# Altium project PCB_Project.PrjPcb
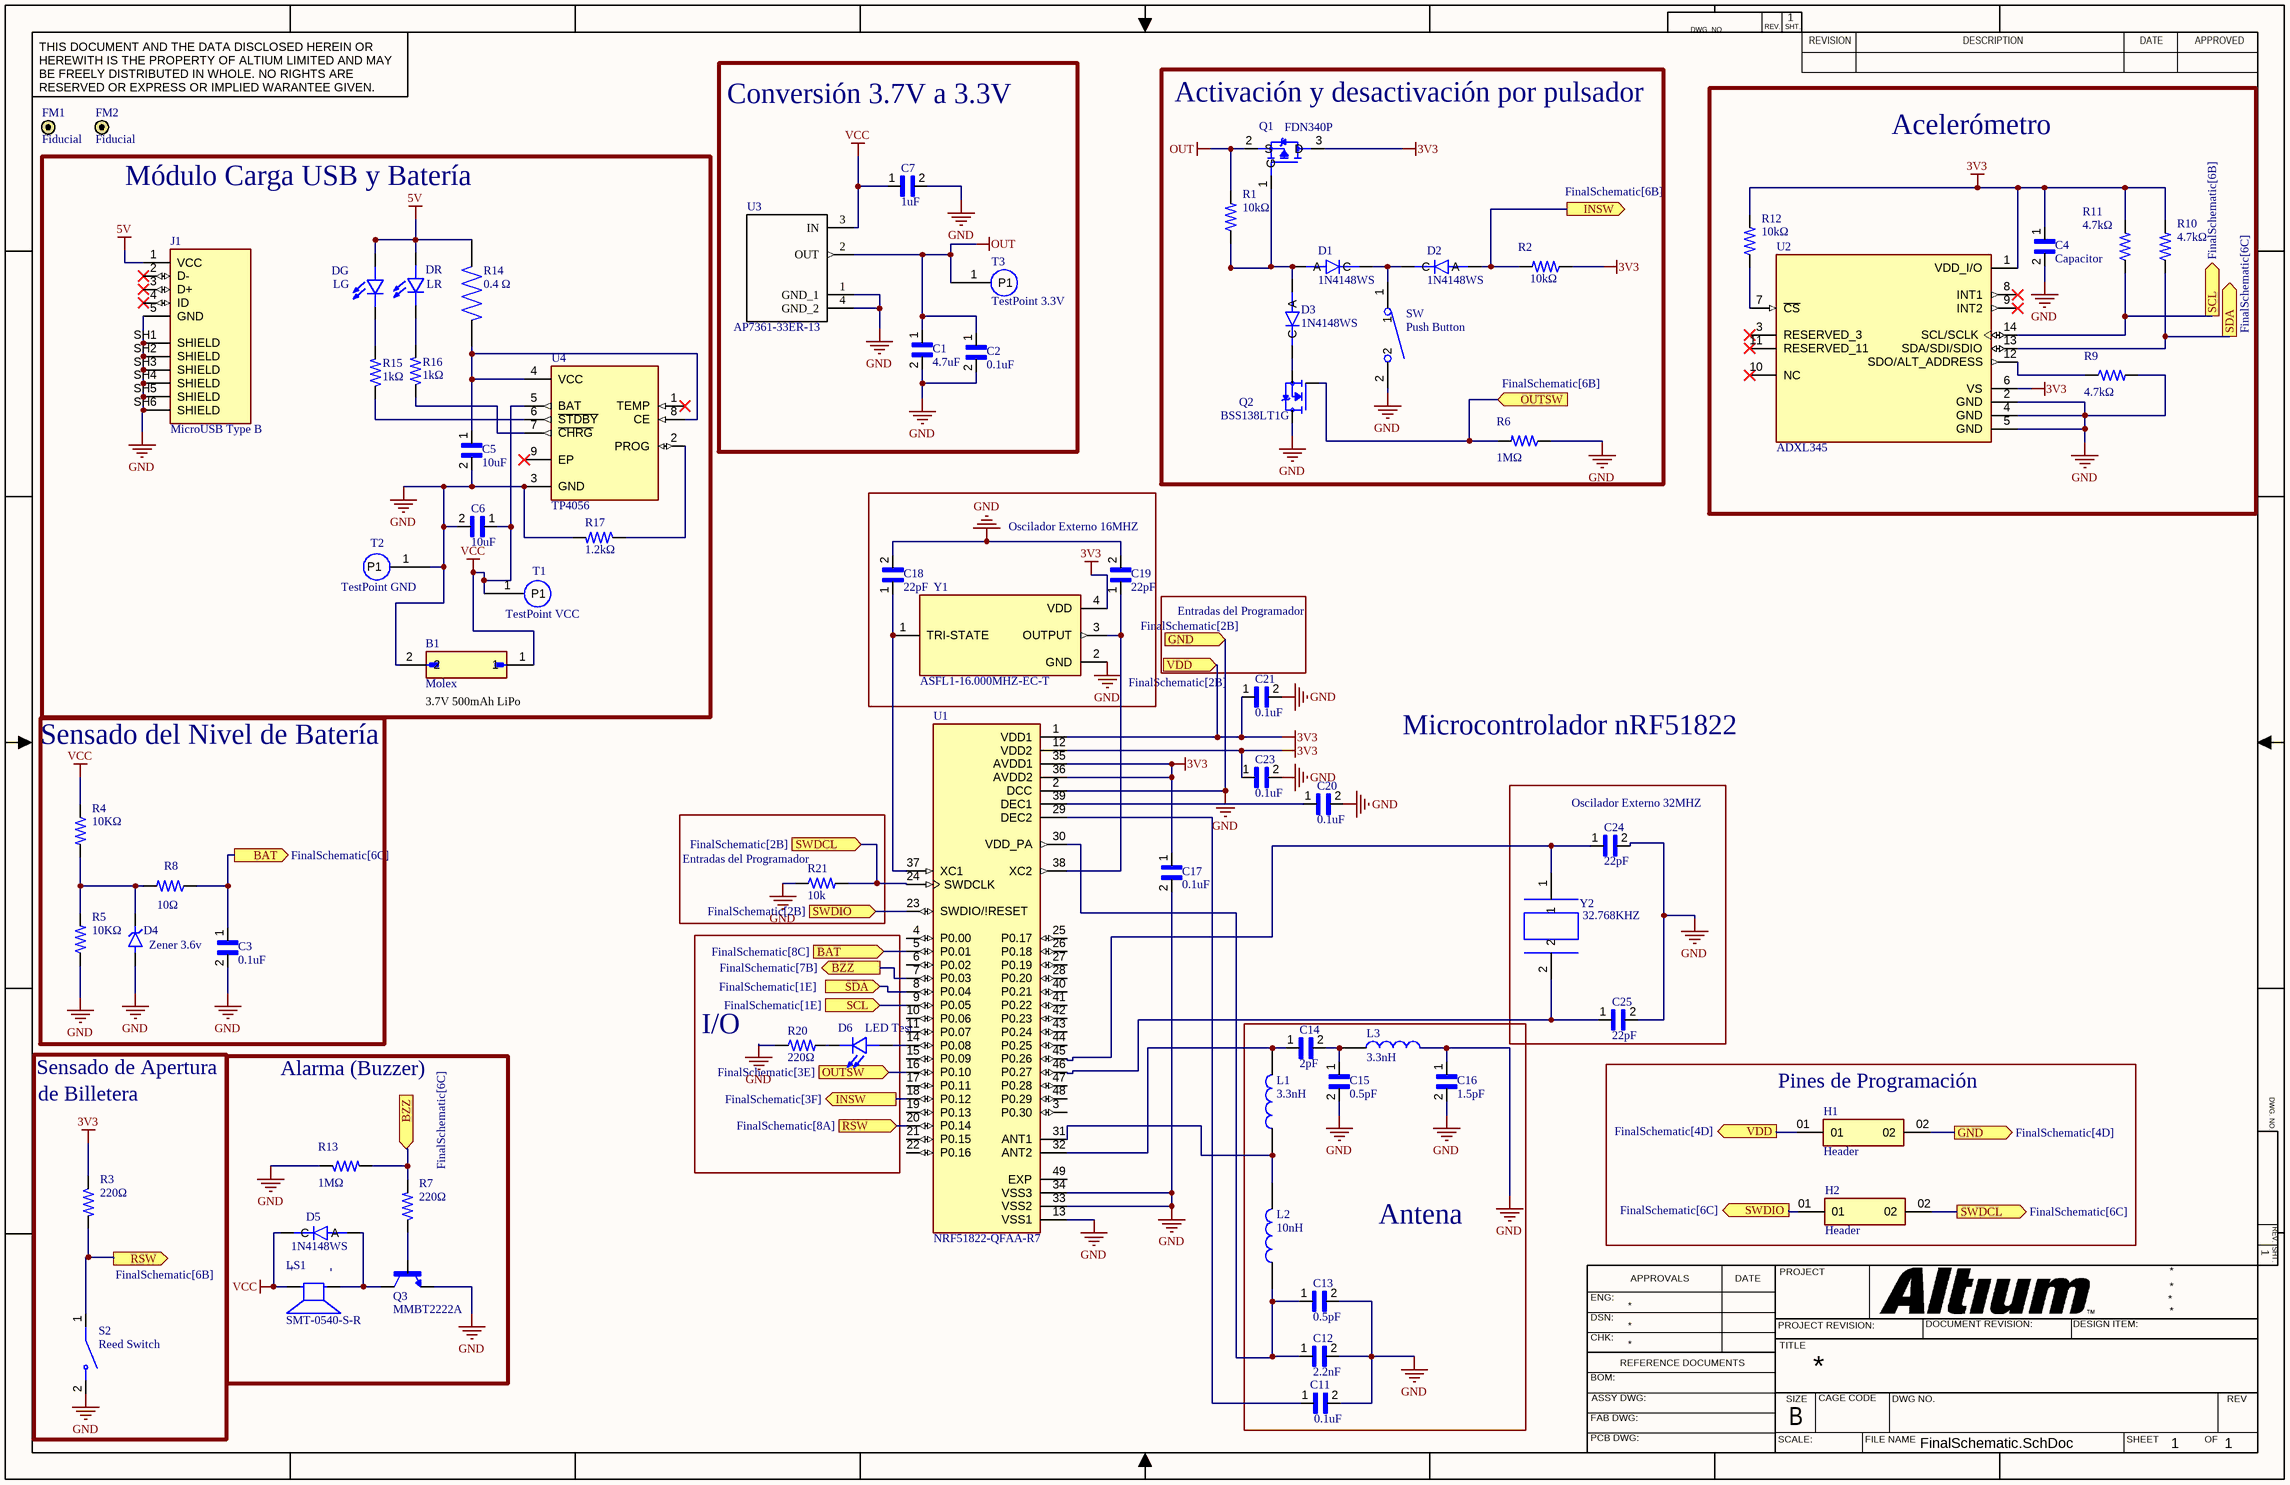
[diagram p0: FinalSchematic.SchDoc]
1 sheet, 72 parts. Net scope: flat (ports and power ports of the same name join across sheets).
Board file: PCB1-V2.PcbDoc

## Sheet FinalSchematic.SchDoc
size 431 x 279 mm; SheetNumber: 1; SheetTotal: 1

### Parts
B1  Molex  [MOLEX_430450227]
C1  4.7uF  [CAPC2012X135N]
C2  0.1uF  [CAPC2012X135N]
C3  0.1uF  [CAPC1608X94N]
C4  Capacitor  [CAPC1608X94N]
C5  10uF  [CAPC2012X135N]
C6  10uF  [CAPC2012X135N]
C7  1uF  [CAPC2012X135N]
C11  0.1uF  [CAPC1608X94N]
C12  2.2nF  [CAPC1608X94N]
C13  0.5pF  [CAPC1608X94N]
C14  2pF  [CAPC1608X94N]
C15  0.5pF  [CAPC1608X94N]
C16  1.5pF  [CAPC1608X94N]
C17  0.1uF  [CAPC1608X94N]
C18  22pF  [CAPC1608X94N]
C19  22pF  [CAPC1608X94N]
C20  0.1uF  [CAPC1608X94N]
C21  0.1uF  [CAPC1608X94N]
C23  0.1uF  [CAPC1608X94N]
C24  22pF  [CAPC1608X94N]
C25  22pF  [CAPC1608X94N]
D1  1N4148WS  [1N4148WS]
D2  1N4148WS  [1N4148WS]
D3  1N4148WS  [1N4148WS]
D4  Zener 3.6v  [DIO_BZT52C3V6S]
D5  1N4148WS  [1N4148WS]
D6  LED Test  [LED_KP-1608SURCK]
DG  LG  [LED_KP-1608SURCK]
DR  LR  [LED_KP-1608SURCK]
FM1  Fiducial  [Fiducial]
FM2  Fiducial  [Fiducial]
H1  Header  [SAMTEC_TMS-101-51-G-D]
H2  Header  [SAMTEC_TMS-101-51-G-D]
J1  MicroUSB Type B  [MicroUSB]
L1  3.3nH  [INDC1608X95N]
L2  10nH  [INDC1608X95N]
L3  3.3nH  [INDC1608X95N]
LS1  SMT-0540-S-R  [SMT-0540-S-R]
Q1  FDN340P  [SOT95P240X120-3N]
Q2  BSS138LT1G  [SOT95P237X111-3N]
Q3  MMBT2222A  [SOT95P240X120-3N]
R1  10kΩ  [RESC1608X50N]
R2  10kΩ  [RESC1608X50N]
R3  220Ω  [RESC1608X50N]
R4  10KΩ  [RESC1608X50N]
R5  10KΩ  [RESC1608X50N]
R6  1MΩ  [RESC1608X50N]
R7  220Ω  [RESC1608X50N]
R8  10Ω  [RESC1608X50N]
R9  4.7kΩ  [RESC1608X50N]
R10  4.7kΩ  [RESC1608X50N]
R11  4.7kΩ  [RESC1608X50N]
R12  10kΩ  [RESC1608X50N]
R13  1MΩ  [RESC1608X50N]
R14  0.4 Ω  [RESC3116X65N]
R15  1kΩ  [RESC1608X50N]
R16  1kΩ  [RESC1608X50N]
R17  1.2kΩ  [RESC1608X50N]
R20  220Ω  [RESC1608X50N]
R21  10k  [RESC1608X50N]
S2  Reed Switch  [SW_PMC-1001S1015]
SW  Push Button  [SW_RS-032G05A3-SMRT]
T1  TestPoint VCC  [Testpoint1]  (no BOM)
T2  TestPoint GND  [Testpoint1]  (no BOM)
T3  TestPoint 3.3V  [Testpoint1]  (no BOM)
U1  NRF51822-QFAA-R7  [nRf51822]
U2  ADXL345  [PQFN80P500X300X100-14N]
U3  AP7361-33ER-13  [*SOT230P700X180-4N]
U4  TP4056  [tp4056]
Y1  ASFL1-16.000MHZ-EC-T  [XTAL_ASFL1-16.000MHZ-EC-T]
Y2  32.768KHZ  [XTAL320X150X75]

### Blocks framed on the sheet
Conversión 3.7V a 3.3V: C1 C2 C7 T3 U3
Activación y desactivación por pulsador: D1-D3 Q1 Q2 R1 R2 R6 SW
Acelerómetro: C4 R9-R12 U2
Módulo Carga USB y Batería: B1 C5 C6 DG DR J1 R14-R17 T1 T2 U4
Oscilador Externo 16MHZ: C18 C19 Y1
Sensado del Nivel de Batería: C3 D4 R4 R5 R8
Oscilador Externo 32MHZ: C24 C25 Y2
Entradas del Programador: R21
I/O: D6 R20
Alarma (Buzzer): D5 LS1 Q3 R7 R13
Antena: C11-C16 L1-L3
Pines de Programación: H1 H2

### Ports
BAT (in, see FinalSchematic[8C]), BAT (out, see FinalSchematic[6C]), BZZ (in, see FinalSchematic[6C]), BZZ (out, see FinalSchematic[7B]), GND (in, see FinalSchematic[2B]), GND (out, see FinalSchematic[4D]), INSW (out, see FinalSchematic[3F]), INSW (out, see FinalSchematic[6B]), OUTSW (in, see FinalSchematic[3E]), OUTSW (in, see FinalSchematic[6B]), RSW (in, see FinalSchematic[8A]), RSW (out, see FinalSchematic[6B]), SCL (in, see FinalSchematic[1E]), SCL (out, see FinalSchematic[6B]), SDA (in, see FinalSchematic[1E]), SDA (out, see FinalSchematic[6C]), SWDCL (in, see FinalSchematic[2B]), SWDCL (out, see FinalSchematic[6C]), SWDIO (in, see FinalSchematic[2B]), SWDIO (out, see FinalSchematic[6C]), VDD (in, see FinalSchematic[2B]), VDD (out, see FinalSchematic[4D])

### Nets
3V3: C4.1 C17.1 C21.1 C23.1 H1.01 Q1.3(D) R2.1 R3.1 R10.2 R11.2 R12.2 U1.1(VDD1) U1.12(VDD2) U1.35(AVDD1) U1.36(AVDD2) U2.1(VDD_I/O) U2.6(VS) Y1.4(VDD) ; port VDD
5V: DG.1(A) DR.1(A) J1.1(VCC) R14.2
GND: B1.2 C1.2 C2.2 C3.2 C4.2 C5.2 C6.2 C7.2 C11.2 C12.2 C13.2 C15.2 C16.1 C16.2 C17.2 C18.2 C19.2 C20.2 C21.2 C23.2 C24.2 C25.2 D4.A H1.02 J1.5(GND) J1.SH1(SHIELD) J1.SH2(SHIELD) J1.SH3(SHIELD) J1.SH4(SHIELD) J1.SH5(SHIELD) J1.SH6(SHIELD) L3.2 Q2.3(D) Q3.2(E) R5.1 R6.1 R9.2 R13.1 R17.2 R20.1 R21.1 S2.2(NO) SW.2 T2.1(P1) U1.2(DCC) U1.13(VSS1) U1.33(VSS2) U1.34(VSS3) U2.2(GND) U2.4(GND) U2.5(GND) U3.1(GND_1) U3.4(GND_2) U4.3(GND) Y1.2(GND) ; port GND
OUT: C1.1 C2.1 Q1.2(S) R1.2 T3.1(P1) U3.2(OUT)
VCC: B1.1 C6.1 C7.1 D5.C LS1.LEAD+(POS) R4.1 T1.1(P1) U3.3(IN) U4.5(BAT)
NetC3_1: C3.1 R8.1 U1.5(P0.01) ; port BAT
NetC5_1: C5.1 R14.1 U4.4(VCC) U4.8(CE)
NetC11_1: C11.1 U1.29(DEC2)
NetC12_1: C12.1 C13.1 L2.1 U1.30(VDD_PA)
NetC14_1: C14.1 L1.2 U1.32(ANT2)
NetC14_2: C14.2 C15.1 L3.1
NetC18_1: C18.1 U1.37(XC1) Y1.1(TRI-STATE)
NetC19_1: C19.1 U1.38(XC2) Y1.3(OUTPUT)
NetC20_1: C20.1 U1.39(DEC1)
NetC24_1: C24.1 U1.45(P0.26) Y2.1
NetC25_1: C25.1 U1.46(P0.27) Y2.2
NetD1_A: D1.A D3.A Q1.1(G) R1.1
NetD1_C: D1.C D2.C SW.1
NetD2_A: D2.A R2.2 U1.18(P0.12) ; port INSW
NetD3_C: D3.C Q2.2(S)
NetD4_C: D4.C(K) R4.2 R5.2 R8.2
NetD5_A: D5.A LS1.LEAD-(NEG) Q3.3(C)
NetD6_1: D6.1(A) U1.14(P0.08)
NetD6_2: D6.2(C) R20.2
NetDG_2: DG.2(C) R15.2
NetDR_2: DR.2(C) R16.2
NetH2_01: H2.01 U1.23(SWDIO/!RESET) ; port SWDIO
NetH2_02: H2.02 R21.2 U1.24(SWDCLK) ; port SWDCL
NetL1_1: L1.1 L2.2 U1.31(ANT1)
NetQ2_1: Q2.1(G) R6.2 U1.16(P0.10) ; port OUTSW
NetQ3_1: Q3.1(B) R7.1
NetR3_2: R3.2 S2.1(COM) U1.20(P0.14) ; port RSW
NetR7_2: R7.2 R13.2 U1.7(P0.03) ; port BZZ
NetR9_1: R9.1 U2.12(SDO/ALT_ADDRESS)
NetR10_1: R10.1 U1.8(P0.04) U2.13(SDA/SDI/SDIO) ; port SDA
NetR11_1: R11.1 U1.9(P0.05) U2.14(SCL/SCLK) ; port SCL
NetR12_1: R12.1 U2.7(~{CS})
NetR15_1: R15.1 U4.6(~{STDBY})
NetR16_1: R16.1 U4.7(~{CHRG})
NetR17_1: R17.1 U4.2(PROG)

Not connected (* = marked no-connect by the designer): J1 2(D-)* 3(D+)* 4(ID)*; U1 3(P0.30) 4(P0.00) 6(P0.02) 10(P0.06) 11(P0.07) 15(P0.09) 17(P0.11) 19(P0.13) 21(P0.15) 22(P0.16) 25(P0.17) 26(P0.18) 27(P0.19) 28(P0.20) 40(P0.21) 41(P0.22) 42(P0.23) 43(P0.24) 44(P0.25) 47(P0.28) 48(P0.29) 49(EXP); U2 3(RESERVED_3)* 8(INT1)* 9(INT2)* 10(NC)* 11(RESERVED_11)*; U4 1(TEMP)* 9(EP)*

### Notes on the sheet
- Entradas del Programador
- (near B1) 3.7V 500mAh LiPo
- Microcontrolador nRF51822
- Sensado de Apertura
- de Billetera
- DWG. NO.
- REV.
- SHT.
- THIS DOCUMENT AND THE DATA DISCLOSED HEREIN OR HEREWITH IS THE PROPERTY OF ALTIUM LIMITED AND MAY BE FREELY DISTRIBUTED IN WHOLE. NO RIGHTS ARE RESERVED OR EXPRESS OR IMPLIED WARANTEE GIVEN.
- REVISION
- DESCRIPTION
- DATE
- APPROVED
- ENG:
- APPROVALS
- PROJECT
- DSN:
- CHK:
- REFERENCE DOCUMENTS
- PROJECT REVISION:
- TITLE
- DOCUMENT REVISION:
- DESIGN ITEM:
- BOM:
- FAB DWG:
- PCB DWG:
- ASSY DWG:
- SCALE:
- SIZE
- B
- CAGE CODE
- FILE NAME
- DWG NO.
- SHEET
- OF
- REV
- (in symbol SMT-0540-S-R) +; -

### Library data of the parts
B1 = Molex: MP: 430450227; Price: None; Availability: Unavailable; Value: *; Package: None
C1 = GCM21BR71H104KA37K: SMD Capacitor X7R(EIA) with Capacitance: 4.7uF Tol. 10%. Rated Voltage: 50Vdc; MF: Murata; SnapEDA_Link: https://www.snapeda.com/parts/GCM21BR71H104KA37K/Murata%20Electronics%20North%20America/view-part/1764792/?ref=snap; Value: *; MP: GCM21BR71H104KA37K; Price: None; Arrow_Electronics-Purchase-URL: https://snapeda.com/shop?store=Arrow+Electronics&id=1764792; Availability: Good; Package: 0805 Murata; DigiKey-Purchase-URL: https://snapeda.com/shop?store=DigiKey&id=1764792
C2 = GCM21BR71H104KA37K: SMD Capacitor X7R(EIA) with Capacitance: 0.10uF Tol. 10%. Rated Voltage: 50Vdc; MF: Murata; SnapEDA_Link: https://www.snapeda.com/parts/GCM21BR71H104KA37K/Murata%20Electronics%20North%20America/view-part/1764792/?ref=snap; Value: *; MP: GCM21BR71H104KA37K; Price: None; Arrow_Electronics-Purchase-URL: https://snapeda.com/shop?store=Arrow+Electronics&id=1764792; Availability: Good; Package: 0805 Murata; DigiKey-Purchase-URL: https://snapeda.com/shop?store=DigiKey&id=1764792
C3 C4 = Capacitor: CAP 0603 0.1uF; MP: VJ0603D100MXCAP; Value: *; Price: None; Availability: Unavailable; Package: None
C5 C6 = GCM21BR71H104KA37K: SMD Capacitor X7R(EIA) with Capacitance: 10uF Tol. 10%. Rated Voltage: 50Vdc; MF: Murata; SnapEDA_Link: https://www.snapeda.com/parts/GCM21BR71H104KA37K/Murata%20Electronics%20North%20America/view-part/1764792/?ref=snap; Value: *; MP: GCM21BR71H104KA37K; Price: None; Arrow_Electronics-Purchase-URL: https://snapeda.com/shop?store=Arrow+Electronics&id=1764792; Availability: Good; Package: 0805 Murata; DigiKey-Purchase-URL: https://snapeda.com/shop?store=DigiKey&id=1764792
C7 = GCM21BR71H104KA37K: CAP 0603 1uF; MF: Murata; Package: 0805 Murata; Price: None; Value: *; MP: GCM21BR71H104KA37K; Availability: Good; SnapEDA_Link: https://www.snapeda.com/parts/GCM21BR71H104KA37K/Murata%20Electronics%20North%20America/view-part/1764792/?ref=snap; Arrow_Electronics-Purchase-URL: https://snapeda.com/shop?store=Arrow+Electronics&id=1764792; DigiKey-Purchase-URL: https://snapeda.com/shop?store=DigiKey&id=1764792
C11 C17 C20 C21 C23 = CAP: CAP 0603 0.1uF; MP: VJ0603D100MXCAP; Package: None; Price: None; Value: *; Availability: Unavailable
C12 = CAP: CAP 0603 2.2nF; MP: VJ0603D100MXCAP; Package: None; Price: None; Value: *; Availability: Unavailable
C13 = Capacitor: CAP 0603 0.5pF; MP: VJ0603D100MXCAP; Package: None; Price: None; Value: *; Availability: Unavailable
C14 = CAP: CAP 0603 2pF; MP: VJ0603D100MXCAP; Package: None; Price: None; Value: *; Availability: Unavailable
C15 = CAP: CAP 0603 0.5pF; MP: VJ0603D100MXCAP; Package: None; Price: None; Value: *; Availability: Unavailable
C16 = CAP: CAP 0603 1.5pF; MP: VJ0603D100MXCAP; Package: None; Price: None; Value: *; Availability: Unavailable
C18 C19 C24 C25 = CAP: CAP 0603 22pF; MP: VJ0603D100MXCAP; Package: None; Price: None; Value: *; Availability: Unavailable
D1-D3 D5 = 1N4148WS: 1N4148WS, SOD-323F, 100V, 0,15A, 150°C; MF: Diotec Semiconductor; Package: SOD-323F Diotec; Check_prices: https://www.snapeda.com/parts/1N4148WS/Diotec/view-part/?ref=eda; Value: *; SnapEDA_Link: https://www.snapeda.com/parts/1N4148WS/Diotec/view-part/?ref=snap; MP: 1N4148WS
D4 = BZT52C3V6S: Zener Diode 3.6 V 200 mW Â±5% Surface Mount SOD-323F; MF: Taiwan Semiconductor; SnapEDA_Link: https://www.snapeda.com/parts/BZT52C3V6S/Taiwan+Semiconductor/view-part/?ref=snap; Package: SOD-323F-2 Taiwan Semiconductor; Value: *; MP: BZT52C3V6S; Check_prices: https://www.snapeda.com/parts/BZT52C3V6S/Taiwan+Semiconductor/view-part/?ref=eda
D6 = LED 0603: LED; SMD; 0603; red; 50-150mcd; 1.6x0.8mm; 120Â°; 20mA;; MF: Kingbright; MP: KP-1608SURCK; SnapEDA_Link: https://www.snapeda.com/parts/KP-1608SURCK/Kingbright/view-part/?ref=snap; Package: 0603 Kingbright; Value: *; Check_prices: https://www.snapeda.com/parts/KP-1608SURCK/Kingbright/view-part/?ref=eda
DG = LED 0603: LED 0603 SMD White; MF: Kingbright; MP: KP-1608SURCK; SnapEDA_Link: https://www.snapeda.com/parts/KP-1608SURCK/Kingbright/view-part/?ref=snap; Package: 0603 Kingbright; Value: *; Check_prices: https://www.snapeda.com/parts/KP-1608SURCK/Kingbright/view-part/?ref=eda
DR = LED 0603: LED 0603 SMD Red; MF: Kingbright; MP: KP-1608SURCK; SnapEDA_Link: https://www.snapeda.com/parts/KP-1608SURCK/Kingbright/view-part/?ref=snap; Package: 0603 Kingbright; Value: *; Check_prices: https://www.snapeda.com/parts/KP-1608SURCK/Kingbright/view-part/?ref=eda
FM1 FM2 = FM?
H1 H2 = Header: Connector Header Through Hole 2 position; MF: Samtec; MP: TMS-101-51-G-D; Availability: In Stock; SnapEDA_Link: https://www.snapeda.com/parts/TMS-101-51-G-D/Samtec/view-part/?ref=snap; Price: None; Check_prices: https://www.snapeda.com/parts/TMS-101-51-G-D/Samtec/view-part/?ref=eda; Package: None; Value: *; Purchase-URL: https://pricing.snapeda.com/search/part/TMS-101-51-G-D/?ref=eda
J1 = MicroUSB Type B: Micro USB, Input Output Connectors, B TYPE RECEPTACLE with flange; MF: Amphenol ICC; MP: 10118194-0001LF; SnapEDA_Link: https://www.snapeda.com/parts/10118194-0001LF/Amphenol+FCI/view-part/?ref=snap; Package: None; Value: *; Check_prices: https://www.snapeda.com/parts/10118194-0001LF/Amphenol+FCI/view-part/?ref=eda
L1 L3 = L: Inductor with Inductance 3.3nH Package 0603 (1608); MP: LQM18DN100M70L; MF: Murata Electronics; Price: None; SnapEDA_Link: https://www.snapeda.com/parts/LQM18DN100M70L/Murata/view-part/4834755/?ref=snap; Package: 0603 Murata; Availability: Unavailable; Value: *
L2 = L: Inductor with Inductance 10nH Package 0603 (1608); MP: LQM18DN100M70L; MF: Murata Electronics; Price: None; SnapEDA_Link: https://www.snapeda.com/parts/LQM18DN100M70L/Murata/view-part/4834755/?ref=snap; Package: 0603 Murata; Availability: Unavailable; Value: *
LS1 = SMT-0540-S-R: MF: {'manufacturer': u'PUI Audio, Inc.'}; Package: None; Price: None; Value: *; MP: SMT-0540-S-R; Availability: Unavailable
Q1 = FDN340P: FDN340P Series 20V 70 mOhm Single P-Ch Logic Level PowerTrench Mosfet SSOT-3; Price: None; MP: FDN340P; Availability: Unavailable; Value: *; Package: None
Q2 = BSS138LT1G: N-Channel 50 V 200mA (Ta) 225mW (Ta) Surface Mount SOT-23-3 (TO-236); MF: onsemi; SnapEDA_Link: https://www.snapeda.com/parts/BSS138LT1G/Onsemi/view-part/?ref=snap; Package: SOT-23-3 Motorola; Value: *; MP: BSS138LT1G; Check_prices: https://www.snapeda.com/parts/BSS138LT1G/Onsemi/view-part/?ref=eda
Q3 = MMBT2222A: BJT, SOT-23, 40V, 600mA, NPN, 0.25W, 150°C; MF: Diotec Semiconductor; SnapEDA_Link: https://www.snapeda.com/parts/MMBT2222A/Diotec/view-part/?ref=snap; Package: SOT-23 Diotec; Value: *; MP: MMBT2222A; Check_prices: https://www.snapeda.com/parts/MMBT2222A/Diotec/view-part/?ref=eda
R1 R2 R12 R21 = RES 0603: 10kΩ 0603 Chip Resistor; MP: 4-2176243-5; Package: None; Price: None; Value: *; Availability: Unavailable
R3 R7 R20 = RES 0603: 220Ω 0603 Chip Resistor; MP: 4-2176243-5; Package: None; Value: *; Price: None; Availability: Unavailable
R4 R5 = RES 0603: 10KΩ 0603 Chip Resistor; MP: 4-2176243-5; Package: None; Value: *; Price: None; Availability: Unavailable
R6 R13 = RES 0603: 1MΩ 0603 Chip Resistor; MP: 4-2176243-5; Package: None; Price: None; Value: *; Availability: Unavailable
R8 = RES 0603: 10Ω 0603 Chip Resistor; MP: 4-2176243-5; Package: None; Value: *; Price: None; Availability: Unavailable
R9-R11 = RES 0603: 4.7kΩ 0603 Chip Resistor; MP: 4-2176243-5; Package: None; Price: None; Value: *; Availability: Unavailable
R14 = RC1206JR-07220RL: 0.4Ω Â±5% 0.25W, 1/4W Chip Resistor 1206 (3216 Metric) Thick Film; MF: Yageo; Digi-Key_Part_Number: 311-220ERCT-ND; Package: 3116 Yageo; Check_prices: https://www.snapeda.com/parts/RC1206JR-07220RL/Yageo/view-part/615364/?ref=eda; Value: *; SnapEDA_Link: https://www.snapeda.com/parts/RC1206JR-07220RL/Yageo/view-part/615364/?ref=snap; MP: RC1206JR-07220RL
R15 R16 = RES 0603: 1kΩ 0603 Chip Resistor; MP: 4-2176243-5; Package: None; Price: None; Value: *; Availability: Unavailable
R17 = RES 0603: 1.2kΩ 0603 Chip Resistor; MP: 4-2176243-5; Package: None; Price: None; Value: *; Availability: Unavailable
S2 = PMC-1001S1015: Price: None; Package: None; Value: *; Availability: Unavailable; MP: PMC-1001S1015
SW = RS-032G05A3-SMRT: Tactile Switch SPST-NO Top Actuated Surface Mount; MF: C&K; MP: RS032G05A3SMRT; Package: None; Value: *; Availability: Unavailable; SnapEDA_Link: https://www.snapeda.com/parts/RS032G05A3SMRT/C%26K/view-part/578384/?ref=snap; Price: None
T1-T3 = T?
U1 = NRF51822-QFAA-R7: IC RF TxRx + MCU Bluetooth, General ISM > 1GHz Bluetooth v4.0 2.4GHz 48-VFQFN Exposed Pad; MF: Nordic; Digi-Key_Part_Number: 1490-1031-1-ND; MP: NRF51822-QFAA-R7; SnapEDA_Link: https://www.snapeda.com/parts/NRF51822-QFAA-R7/Nordic%20Semiconductor%20ASA/view-part/50620/?ref=snap; Value: *; Package: VFQFN-48 Nordic Semiconductor; Digi-Key_Purchase_URL: https://www.digikey.com/product-detail/en/nordic-semiconductor-asa/NRF51822-QFAA-R7/1490-1031-1-ND/4626399?utm_source=snapeda&utm_medium=aggregator&utm_campaign=symbol
U2 = ADXL345: Accelerometer X, Y, Z Axis ±2g, 4g, 8g, 16g 0.05Hz ~ 1.6kHz 14-LGA (3x5); MF: Analog Devices, Inc.; SnapEDA_Link: https://www.snapeda.com/parts/ADXL345/Analog+Devices/view-part/?ref=snap; Package: LGA -14 Analog Devices; Value: *; MP: ADXL345; Check_prices: https://www.snapeda.com/parts/ADXL345/Analog+Devices/view-part/?ref=eda
U4 = TP4056: Complete single cell Li-Ion battery with a constant current / constant voltage linear charger; MF: NanJing Top Power ASIC Corp.; Check_prices: https://www.snapeda.com/parts/TP4056/NanJing+Top+Power+ASIC+Corp./view-part/?ref=eda; SnapEDA_Link: https://www.snapeda.com/parts/TP4056/NanJing+Top+Power+ASIC+Corp./view-part/?ref=snap; Price: None; Availability: Not in stock; Package: Package; MP: TP4056; Value: *
Y2 = 9HT10-32.768KAZB-T: Crystal, 32.768khz, 12.5pf, 3.2 x 1.5mm; Package: None; Price: None; Value: *; MP: 9HT10-32.768KAZB-T; Availability: Unavailable
U3 = AP7361-33ER-13: SnapEDA_Link: https://www.snapeda.com/parts/AP7361-33ER-13/Diodes+Inc./view-part/?ref=snap; Check_prices: https://www.snapeda.com/parts/AP7361-33ER-13/Diodes+Inc./view-part/?ref=eda; Value: *
Y1 = ASFL1-16.000MHZ-EC-T: Price: None; Availability: Unavailable; Value: *; MP: ASFL1-16.000MHZ-EC-T; Package: None